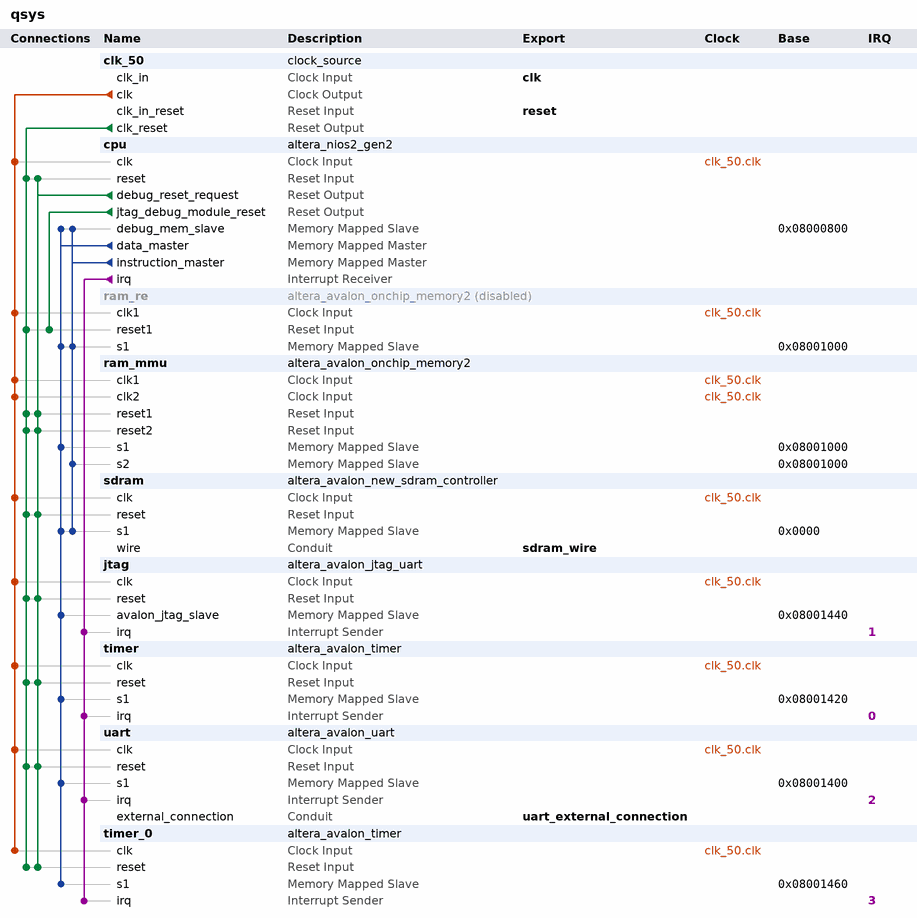
[diagram p0: system contents]
# Platform Designer (Qsys) system qsys, Cyclone IV E EP4CE115F29C7
# Parameters at their usual value, and those the tool derives, are not listed.
package require -exact qsys 16.1
create_system qsys
set_project_property DEVICE_FAMILY {Cyclone IV E}
set_project_property DEVICE EP4CE115F29C7

add_instance clk_50 clock_source 16.1
set_instance_parameter_value clk_50 clockFrequency 50000000

add_instance cpu altera_nios2_gen2 16.1
set_instance_parameter_value cpu dcache_size 2048
set_instance_parameter_value cpu exceptionSlave sdram.s1
set_instance_parameter_value cpu icache_size 4096
set_instance_parameter_value cpu impl Fast
set_instance_parameter_value cpu mmu_TLBMissExcSlave ram_mmu.s2
set_instance_parameter_value cpu mmu_enabled true
set_instance_parameter_value cpu resetSlave sdram.s1
set_instance_parameter_value cpu setting_activateTrace true

add_instance ram_re altera_avalon_onchip_memory2 16.1
set_instance_property ram_re ENABLED false
set_instance_parameter_value ram_re dataWidth 32
set_instance_parameter_value ram_re dualPort false
set_instance_parameter_value ram_re initMemContent true
set_instance_parameter_value ram_re initializationFileName ram_re
set_instance_parameter_value ram_re memorySize 4096

add_instance ram_mmu altera_avalon_onchip_memory2 16.1
set_instance_parameter_value ram_mmu dataWidth 32
set_instance_parameter_value ram_mmu dualPort true
set_instance_parameter_value ram_mmu initMemContent true
set_instance_parameter_value ram_mmu initializationFileName ram_mmu
set_instance_parameter_value ram_mmu memorySize 1024

add_instance sdram altera_avalon_new_sdram_controller 16.1
set_instance_parameter_value sdram TAC 5.5
set_instance_parameter_value sdram TRCD 20.0
set_instance_parameter_value sdram TRP 20.0
set_instance_parameter_value sdram casLatency 3
set_instance_parameter_value sdram columnWidth 10
set_instance_parameter_value sdram dataWidth 32
set_instance_parameter_value sdram generateSimulationModel false
set_instance_parameter_value sdram model custom
set_instance_parameter_value sdram numberOfBanks 4
set_instance_parameter_value sdram numberOfChipSelects 1
set_instance_parameter_value sdram powerUpDelay 100.0
set_instance_parameter_value sdram refreshPeriod 15.625
set_instance_parameter_value sdram rowWidth 13

add_instance jtag altera_avalon_jtag_uart 16.1
set_instance_parameter_value jtag simInteractiveOptions INTERACTIVE_ASCII_OUTPUT

add_instance timer altera_avalon_timer 16.1
set_instance_parameter_value timer period 1
set_instance_parameter_value timer periodUnits MSEC

add_instance uart altera_avalon_uart 16.1
set_instance_parameter_value uart baud 115200
set_instance_parameter_value uart dataBits 8
set_instance_parameter_value uart fixedBaud true
set_instance_parameter_value uart parity NONE
set_instance_parameter_value uart stopBits 1

add_instance timer_0 altera_avalon_timer 16.1
set_instance_parameter_value timer_0 period 1
set_instance_parameter_value timer_0 periodUnits MSEC

# connections
add_connection clk_50.clk cpu.clk clock
add_connection clk_50.clk jtag.clk clock
add_connection clk_50.clk ram_mmu.clk1 clock
add_connection clk_50.clk ram_mmu.clk2 clock
add_connection clk_50.clk ram_re.clk1 clock
add_connection clk_50.clk sdram.clk clock
add_connection clk_50.clk timer.clk clock
add_connection clk_50.clk timer_0.clk clock
add_connection clk_50.clk uart.clk clock
add_connection clk_50.clk_reset cpu.reset reset
add_connection clk_50.clk_reset jtag.reset reset
add_connection clk_50.clk_reset ram_mmu.reset1 reset
add_connection clk_50.clk_reset ram_mmu.reset2 reset
add_connection clk_50.clk_reset ram_re.reset1 reset
add_connection clk_50.clk_reset sdram.reset reset
add_connection clk_50.clk_reset timer.reset reset
add_connection clk_50.clk_reset timer_0.reset reset
add_connection clk_50.clk_reset uart.reset reset
add_connection cpu.debug_reset_request cpu.reset reset
add_connection cpu.debug_reset_request jtag.reset reset
add_connection cpu.debug_reset_request ram_mmu.reset1 reset
add_connection cpu.debug_reset_request ram_mmu.reset2 reset
add_connection cpu.debug_reset_request sdram.reset reset
add_connection cpu.debug_reset_request timer.reset reset
add_connection cpu.debug_reset_request timer_0.reset reset
add_connection cpu.debug_reset_request uart.reset reset
add_connection cpu.jtag_debug_module_reset ram_re.reset1 reset
add_connection cpu.data_master cpu.debug_mem_slave avalon
set_connection_parameter_value cpu.data_master/cpu.debug_mem_slave baseAddress 0x08000800
add_connection cpu.data_master jtag.avalon_jtag_slave avalon
set_connection_parameter_value cpu.data_master/jtag.avalon_jtag_slave baseAddress 0x08001440
add_connection cpu.data_master ram_mmu.s1 avalon
set_connection_parameter_value cpu.data_master/ram_mmu.s1 baseAddress 0x08001000
add_connection cpu.data_master ram_re.s1 avalon
set_connection_parameter_value cpu.data_master/ram_re.s1 baseAddress 0x08001000
add_connection cpu.data_master sdram.s1 avalon
set_connection_parameter_value cpu.data_master/sdram.s1 baseAddress 0x0000
add_connection cpu.data_master timer.s1 avalon
set_connection_parameter_value cpu.data_master/timer.s1 baseAddress 0x08001420
add_connection cpu.data_master timer_0.s1 avalon
set_connection_parameter_value cpu.data_master/timer_0.s1 baseAddress 0x08001460
add_connection cpu.data_master uart.s1 avalon
set_connection_parameter_value cpu.data_master/uart.s1 baseAddress 0x08001400
add_connection cpu.instruction_master cpu.debug_mem_slave avalon
set_connection_parameter_value cpu.instruction_master/cpu.debug_mem_slave baseAddress 0x08000800
add_connection cpu.instruction_master ram_mmu.s2 avalon
set_connection_parameter_value cpu.instruction_master/ram_mmu.s2 baseAddress 0x08001000
add_connection cpu.instruction_master ram_re.s1 avalon
set_connection_parameter_value cpu.instruction_master/ram_re.s1 baseAddress 0x08001000
add_connection cpu.instruction_master sdram.s1 avalon
set_connection_parameter_value cpu.instruction_master/sdram.s1 baseAddress 0x0000
add_connection cpu.irq jtag.irq interrupt
set_connection_parameter_value cpu.irq/jtag.irq irqNumber 1
add_connection cpu.irq timer.irq interrupt
set_connection_parameter_value cpu.irq/timer.irq irqNumber 0
add_connection cpu.irq timer_0.irq interrupt
set_connection_parameter_value cpu.irq/timer_0.irq irqNumber 3
add_connection cpu.irq uart.irq interrupt
set_connection_parameter_value cpu.irq/uart.irq irqNumber 2

# exported interfaces
add_interface clk clock sink
set_interface_property clk EXPORT_OF clk_50.clk_in
add_interface reset reset sink
set_interface_property reset EXPORT_OF clk_50.clk_in_reset
add_interface sdram_wire conduit end
set_interface_property sdram_wire EXPORT_OF sdram.wire
add_interface uart_external_connection conduit end
set_interface_property uart_external_connection EXPORT_OF uart.external_connection

set_interconnect_requirement {$system} qsys_mm.clockCrossingAdapter HANDSHAKE
set_interconnect_requirement {$system} qsys_mm.maxAdditionalLatency 1

save_system qsys.qsys
